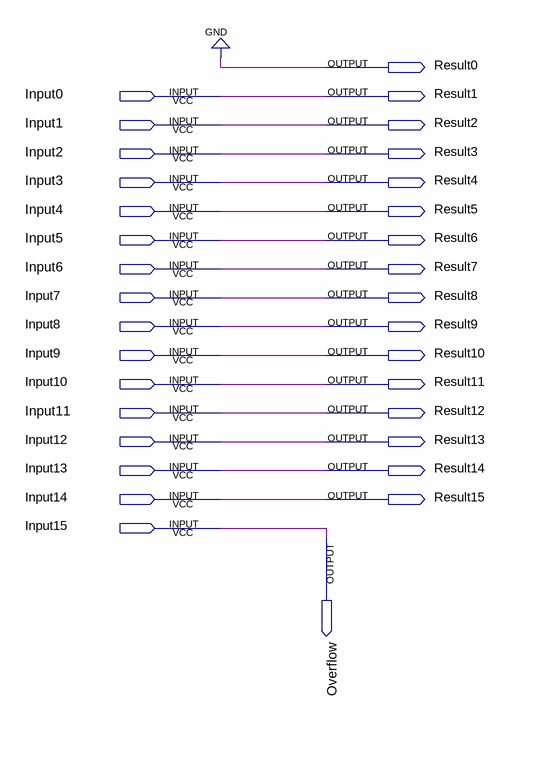
[diagram p0: schematic sheet]
// Quartus schematic shift1left16bit.bdf as structural Verilog: 0 symbols, 33 pins
module shift1left16bit (
  input  Input0,
  input  Input1,
  input  Input2,
  input  Input3,
  input  Input4,
  input  Input5,
  input  Input6,
  input  Input7,
  input  Input8,
  input  Input9,
  input  Input10,
  input  Input11,
  input  Input12,
  input  Input13,
  input  Input14,
  input  Input15,
  output Result0,
  output Result1,
  output Result2,
  output Result3,
  output Result4,
  output Result5,
  output Result6,
  output Result7,
  output Result8,
  output Result9,
  output Result10,
  output Result11,
  output Result12,
  output Result13,
  output Result14,
  output Result15,
  output Overflow
);


  assign Overflow = Input15;
  assign Result0 = 1'b0;
  assign Result1 = Input0;
  assign Result2 = Input1;
  assign Result3 = Input2;
  assign Result4 = Input3;
  assign Result5 = Input4;
  assign Result6 = Input5;
  assign Result7 = Input6;
  assign Result8 = Input7;
  assign Result9 = Input8;
  assign Result10 = Input9;
  assign Result11 = Input10;
  assign Result12 = Input11;
  assign Result13 = Input12;
  assign Result14 = Input13;
  assign Result15 = Input14;
endmodule
